# EAGLE design wt32_breakout_v10 (EAGLE 6.4)
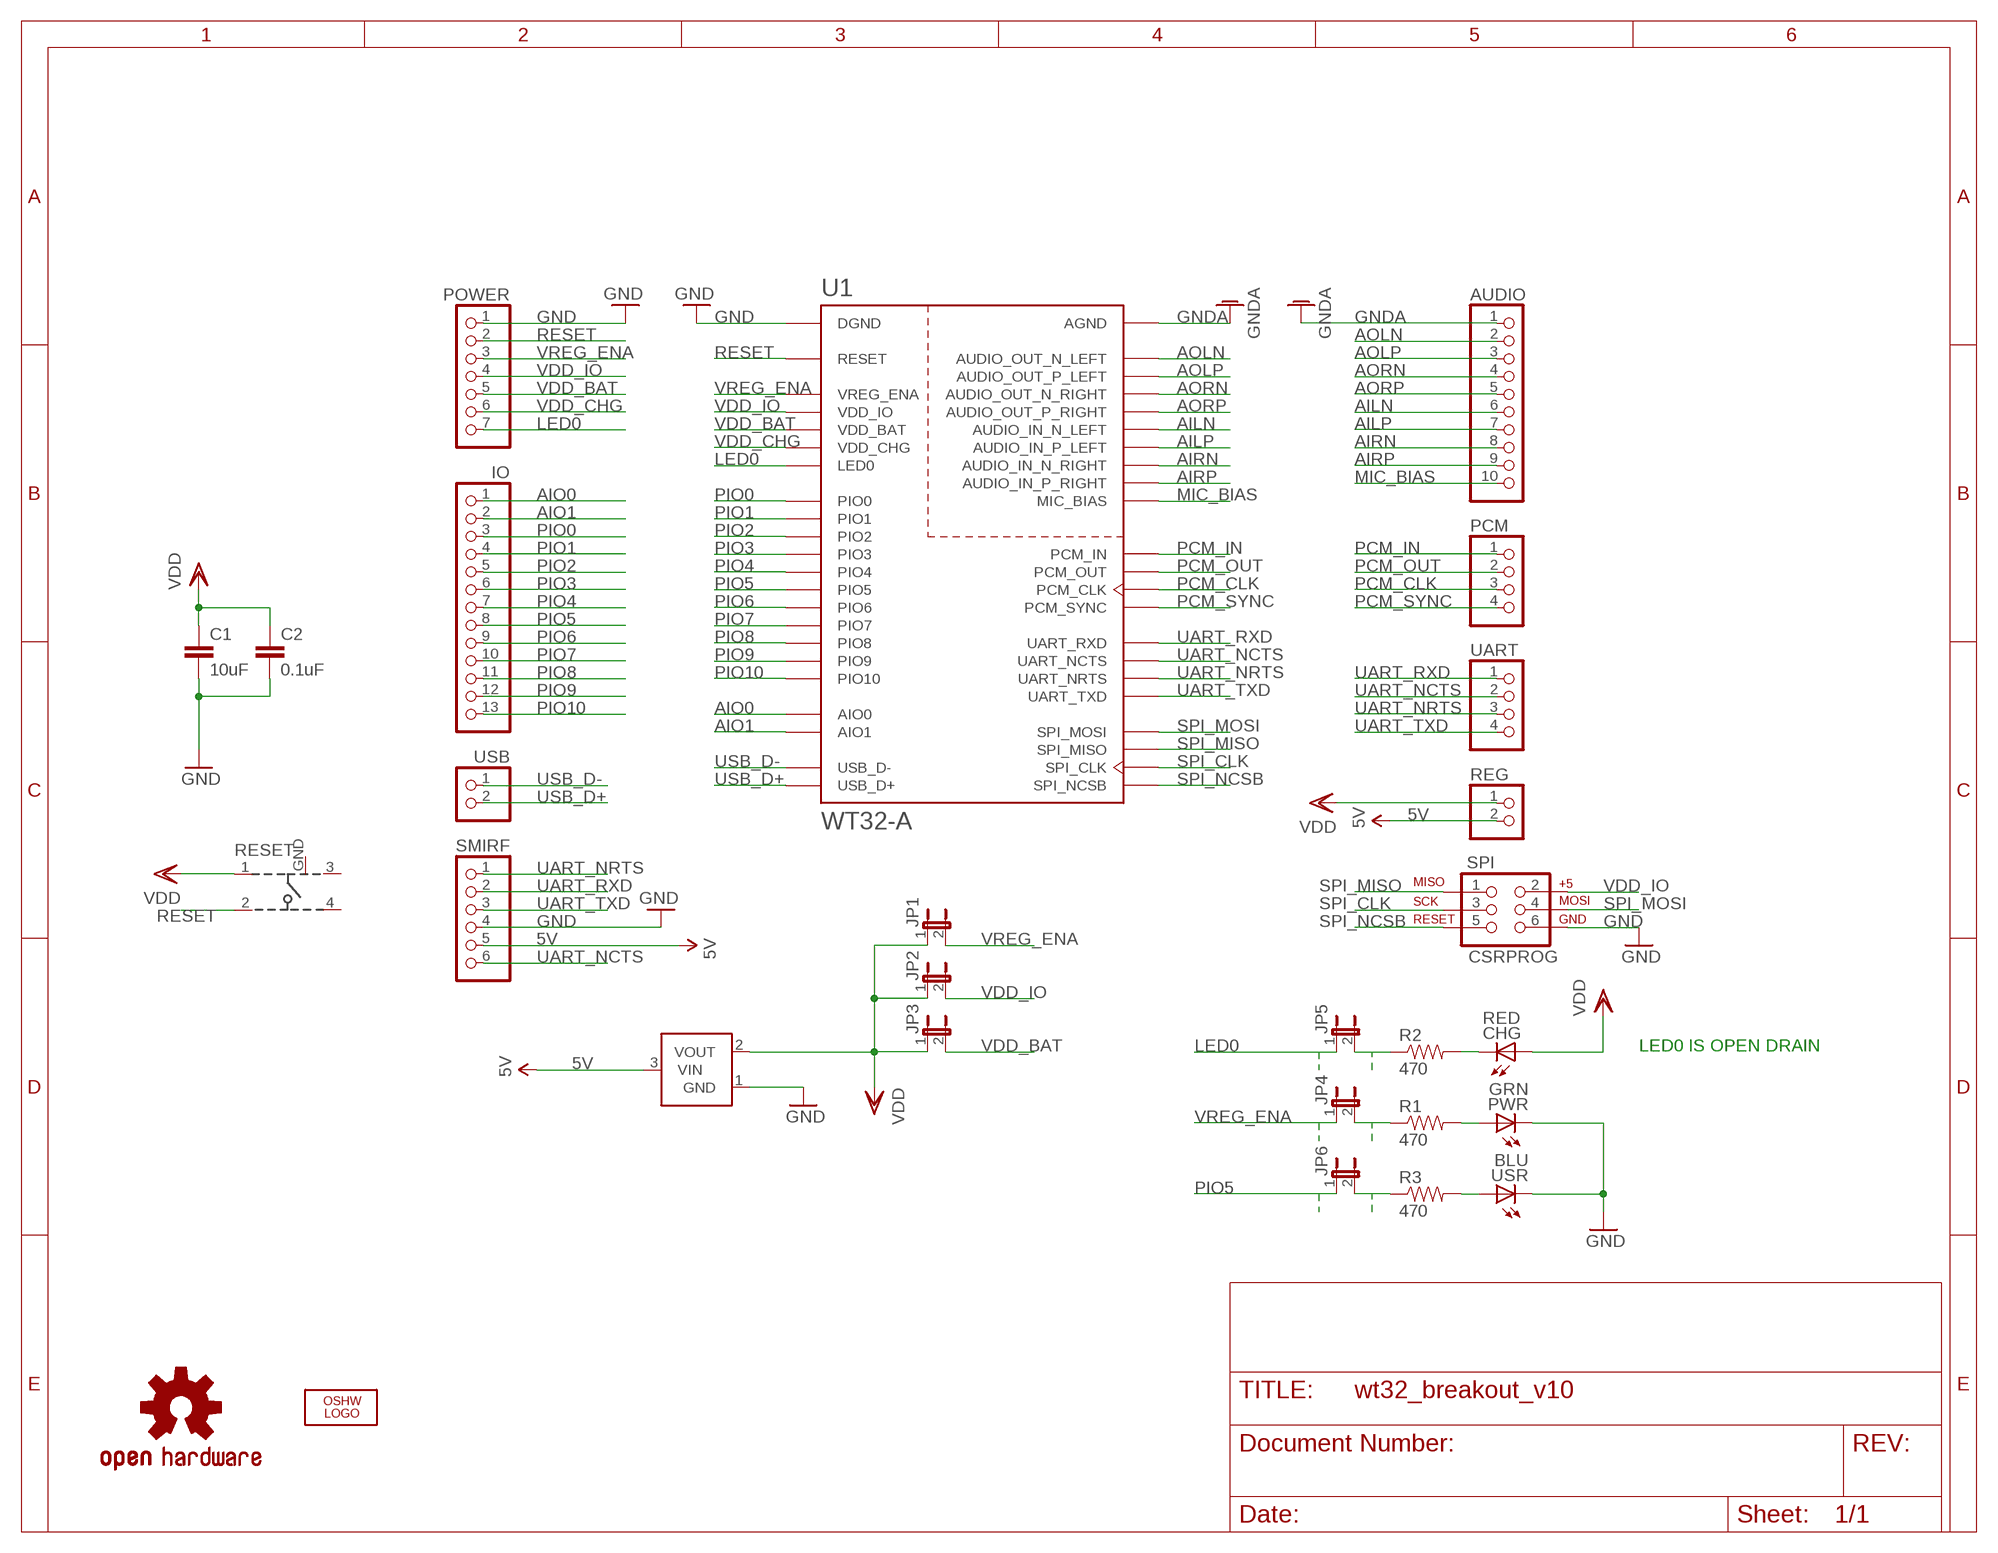
[diagram p0: schematic, sheet 1]

## Parts
AUDIO  PINHD-1X10  [1X10]
C1  10uF  CAP0603-CAP  [0603-CAP]
C2  0.1uF  CAP0603-CAP  [0603-CAP]
CHG  RED  LEDCHIPLED_0805  [CHIPLED_0805]
IO  PINHD-1X13  [1X13]
JP1  JUMPER-2PTH  [1X02]
JP2  JUMPER-2PTH  [1X02]
JP3  JUMPER-2PTH  [1X02]
JP4  JUMPER-2SMD-NC  [SJ_2S]
JP5  JUMPER-2SMD-NC  [SJ_2S]
JP6  JUMPER-2SMD-NC  [SJ_2S]
LOGO1  OSHW_LOGO_FILLX0070-NT  [OSHW_FILLX70_NOTEXT]
PCM  PINHD-1X4  [1X04]
POWER  PINHD-1X7  [1X07]
PWR  GRN  LEDCHIPLED_0805  [CHIPLED_0805]
R1  470  RESISTOR0603-RES  [0603-RES]
R2  470  RESISTOR0603-RES  [0603-RES]
R3  470  RESISTOR0603-RES  [0603-RES]
REG  PINHD-1X2  [1X02]
RESET  101-IG  [101-IG]
SMIRF  PINHD-1X6  [1X06]
SPI  CSRPROG  AVR_SPI_PRG_6PTH  [2X3]
U1  WT32-A  [WT32-A]
U2  MCP1700  [SOT23-3]
U$5  OSHW-LOGOM  [OSHW-LOGO-M]
UART  PINHD-1X4  [1X04]
USB  PINHD-1X2  [1X02]
USR  BLU  LEDCHIPLED_0805  [CHIPLED_0805]

## Nets
5V [power]: REG.2 SMIRF.5 U2.3(VIN)
AILN: AUDIO.6 U1.AUDIO_IN_N_LEFT
AILP: AUDIO.7 U1.AUDIO_IN_P_LEFT
AIO0: IO.1 U1.AIO0
AIO1: IO.2 U1.AIO1
AIRN: AUDIO.8 U1.AUDIO_IN_N_RIGHT
AIRP: AUDIO.9 U1.AUDIO_IN_P_RIGHT
AOLN: AUDIO.2 U1.AUDIO_OUT_N_LEFT
AOLP: AUDIO.3 U1.AUDIO_OUT_P_LEFT
AORN: AUDIO.4 U1.AUDIO_OUT_N_RIGHT
AORP: AUDIO.5 U1.AUDIO_OUT_P_RIGHT
GND [power]: C1.2 C2.2 POWER.1 PWR.C SMIRF.4 SPI.6 U1.DGND U1.DGND@2(DGND) U1.DGND@3(DGND) U1.DGND@4(DGND) U1.DGND@5(DGND) U2.1(GND) USR.C
GNDA: AUDIO.1 U1.AGND U1.AGND@2(AGND) U1.AGND@3(AGND)
LED0: JP5.1 POWER.7 U1.LED0
MIC_BIAS: AUDIO.10 U1.MIC_BIAS
N$1: PWR.A R1.2
N$2: CHG.C R2.2
N$3: R3.2 USR.A
N$4: JP6.2 R3.1
N$5: JP4.2 R1.1
N$6: JP5.2 R2.1
PCM_CLK: PCM.3 U1.PCM_CLK
PCM_IN: PCM.1 U1.PCM_IN
PCM_OUT: PCM.2 U1.PCM_OUT
PCM_SYNC: PCM.4 U1.PCM_SYNC
PIO0: IO.3 U1.PIO0
PIO1: IO.4 U1.PIO1
PIO2: IO.5 U1.PIO2
PIO3: IO.6 U1.PIO3
PIO4: IO.7 U1.PIO4
PIO5: IO.8 JP6.1 U1.PIO5
PIO6: IO.9 U1.PIO6
PIO7: IO.10 U1.PIO7
PIO8: IO.11 U1.PIO8
PIO9: IO.12 U1.PIO9
PIO10: IO.13 U1.PIO10
RESET: POWER.2 RESET.2 U1.RESET
SPI_CLK: SPI.3 U1.SPI_CLK
SPI_MISO: SPI.1 U1.SPI_MISO
SPI_MOSI: SPI.4 U1.SPI_MOSI
SPI_NCSB: SPI.5 U1.SPI_NCSB
UART_NCTS: SMIRF.6 U1.UART_NCTS UART.2
UART_NRTS: SMIRF.1 U1.UART_NRTS UART.3
UART_RXD: SMIRF.2 U1.UART_RXD UART.1
UART_TXD: SMIRF.3 U1.UART_TXD UART.4
USB_D+: U1.USB_D+ USB.2
USB_D-: U1.USB_D- USB.1
VDD [power]: C1.1 C2.1 CHG.A JP1.1 JP2.1 JP3.1 REG.1 RESET.1 U2.2(VOUT)
VDD_BAT [power]: JP3.2 POWER.5 U1.VDD_BAT
VDD_CHG: POWER.6 U1.VDD_CHG
VDD_IO: JP2.2 POWER.4 SPI.2 U1.VDD_IO
VREG_ENA: JP1.2 JP4.1 POWER.3 U1.VREG_ENA
Unconnected: RESET.3 RESET.4

## Notes on the sheet
- LED0 IS OPEN DRAIN

## Power pins joined to a net without a drawn wire
GND: RESET.GND

## Library data of the parts
AUDIO = sf-pinhead:PINHD-1X10: PIN HEADER
C1 C2 = SparkFun:CAP: Capacitor Standard 0603 ceramic capacitor, and 0.1" leaded capacitor.
CHG PWR USR = adafruit:LED: LED OSRAM: - CHIPLED LG R971, LG N971, LY N971, LG Q971, LY Q971, LO R971, LY R971 LH N974, LH R974 LS Q976, LO Q976, LY Q976 LO Q996 - Hyper CHIPLED LW Q18S LB Q993, LB Q99A, LB R99A - SideLED LS A670, LO A670, LY A670, LG A670, LP A670 LB A673, LV A673, LT A673, LW A673 LH A674 LY A675 LS A676, LA A676, LO A676, LY A676, LW A676 LS A679, LY A679, LG A679 - Hyper Micro SIDELED® LS Y876, LA Y876, LO Y876, LY Y876 LT Y87S - SmartLED LW L88C, LW L88S LB L89C, LB L89S, LG L890 LS L89K, LO L89K, LY L89K LS L896, LA L896, LO L896, LY L896 - TOPLED LS T670, LO T670, LY T670, LG T670, LP T670 LSG T670, LSP T670, LSY T670, LOP T670, LYG T670 LG T671, LOG T671, LSG T671 LB T673, LV T673, LT T673, LW T673 LH T674 LS T676, LA T676, LO T676, LY T676, LB T676, LH T676, LSB T676, LW T676 LB T67C, LV T67C, LT T67C, LS T67K, LO T67K, LY T67K, LW E67C LS E67B, LA E67B, LO E67B, LY E67B, LB E67C, LV E67C, LT E67C LW T67C LS T679, LY T679, LG T679 LS T770, LO T770, LY T770, LG T770, LP T770 LB T773, LV T773, LT T773, LW T773 LH T774 LS E675, LA E675, LY E675, LS T675 LS T776, LA T776, LO T776, LY T776, LB T776 LHGB T686 LT T68C, LB T68C - Hyper Mini TOPLED® LB M676 - Mini TOPLED Santana® LG M470 LS M47K, LO M47K, LY M47K Source: http://www.osram.convergy.de/
IO = sf-pinhead:PINHD-1X13: PIN HEADER
JP1-JP6 = SparkFun:JUMPER-2: Jumper Basic 0.1" spaced jumper. Use with breakaway headers.
LOGO1 = oshw-logo:OSHW_LOGO_FILL
PCM UART = sf-pinhead:PINHD-1X4: PIN HEADER
POWER = sf-pinhead:PINHD-1X7: PIN HEADER
R1-R3 = SparkFun:RESISTOR: Resistor Basic schematic elements and footprints for 0603, 1206, and PTH resistors.
REG USB = sf-pinhead:PINHD-1X2: PIN HEADER
RESET = sf-keyglove:101-IG
SMIRF = sf-pinhead:PINHD-1X6: PIN HEADER
SPI = SparkFun:AVR_SPI_PRG_6: AVR ISP 6 Pin This is the reduced ISP connector for AVR programming. Common on Arduino. This footprint will take up less PCB space and can be used with a 10-pin to 6-pin adapter such as SKU: BOB-08508
U1 = sf-bluegiga:WT32-A: Class 2 Bluetooth Audio module - Bluetooth 2.1 + EDR w/stereo analog audio (A2DP) support, chip antenna
U2 = nonolith:MCP1700: Voltage regulator
U$5 = SparkFun:OSHW-LOGO: Open Source Hardware Logo This logo indicates the piece of hardware it is found on incorporates a OSHW license and/or adheres to the definition of open source hardware found here: http://freedomdefined.org/OSHW

## Net classes
0 default: width 0.152 mm, drill 0.33 mm, clearance 0.152 mm
1 power: width 0.254 mm, drill 0.33 mm, clearance 0.152 mm

## Board
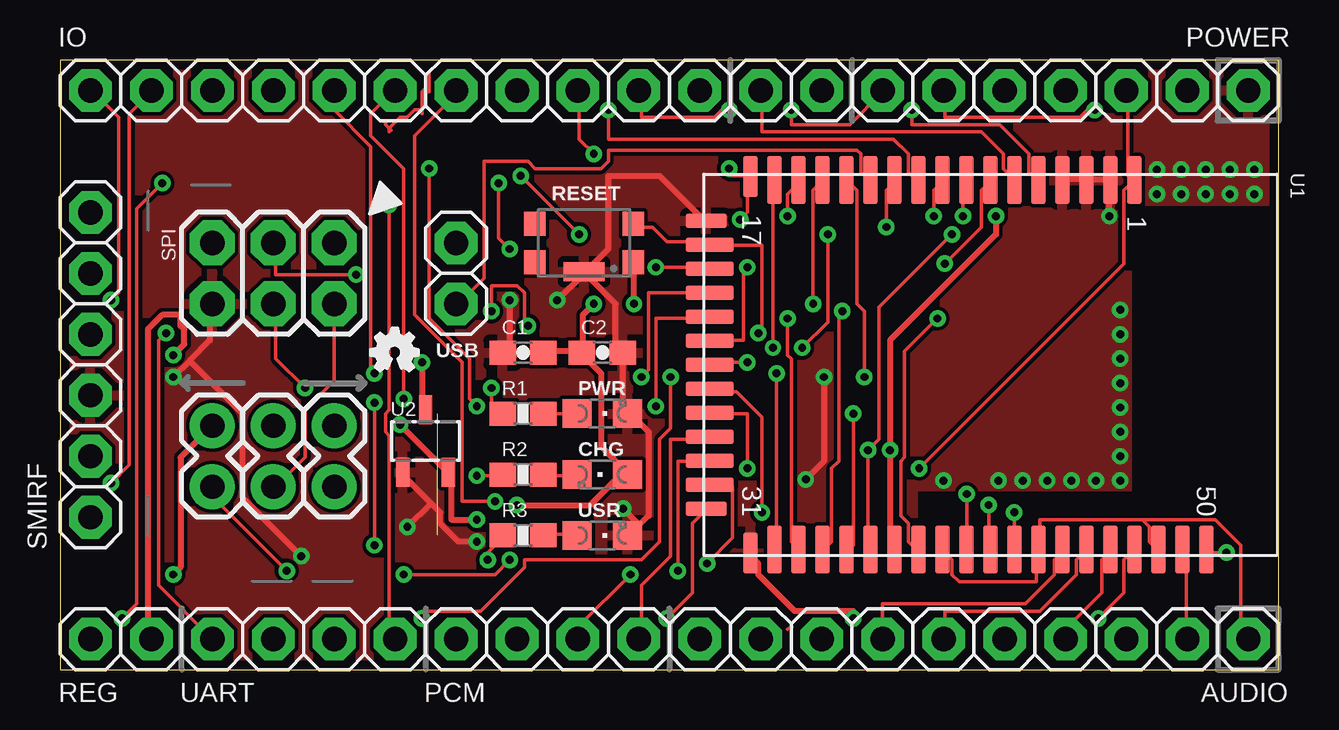
[diagram p1: board, top side]
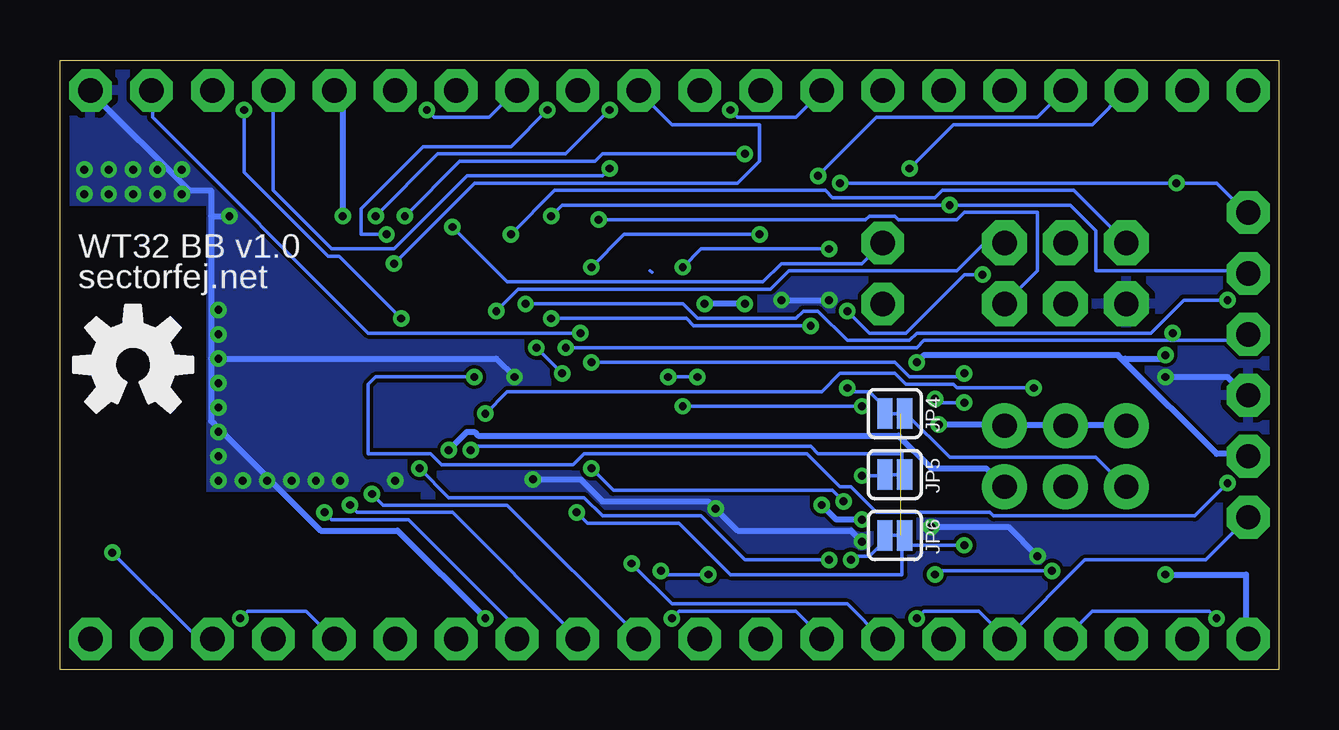
[diagram p2: board, bottom side, seen from below]

Size 50.8 x 25.4 mm. Coordinates in mm from the lower left corner, seen from the top.
Outline: 0,0 50.8,0 50.8,25.4 0,25.4 0,0
Copper layers (1*16): Top 0.0356mm / dielectric 1.5011mm / Bottom 0.0356mm
Design rules "LaenPCBOrder *": minimum track width 6mil, minimum drill 13mil, track to track 6mil, track to pad 6mil, pad to pad 6mil, via to via 6mil, smd to smd 6mil, copper to edge 15mil, drill to drill 6mil, minimum pad ring 7mil, minimum via ring 7mil, stop-mask expansion 4mil, vias tented up to drill 13mil, thermal gap 10mil
tRestrict: area 44.7,6.6 to 50.8,19.3
bRestrict: area 44.7,6.6 to 50.8,19.3
vRestrict: area 0,22 to 50.8,22.9; area 0,2.5 to 50.8,3.6; area 2.5,5.1 to 3.8,20.3; area 5.1,19.1 to 12.7,20.3; area 5.1,12.7 to 12.7,14; area 5.1,5.1 to 12.7,6.3; area 21.6,11.4 to 23.1,11.9; area 21.6,8.9 to 23.1,9.4; area 21.6,6.3 to 23.1,6.9

### Footprints (pad centres in the part's own frame; a part is rotated, then mirrored left to right if it is on the bottom)
1X10 = drill 1.016 pad 1.778 octagon: 1 -11.43,0; 2 -8.89,0; 3 -6.35,0; 4 -3.81,0; 5 -1.27,0; 6 1.27,0; 7 3.81,0; 8 6.35,0; 9 8.89,0; 10 11.43,0
0603-CAP = smd 1.1 x 1: 1 -0.85,0; 2 0.85,0
CHIPLED_0805 = smd 1.2 x 1.2: A 0,-1.05; C 0,1.05
1X13 = drill 1.016 pad 1.778 octagon: 1 -15.24,0; 2 -12.7,0; 3 -10.16,0; 4 -7.62,0; 5 -5.08,0; 6 -2.54,0; 7 0,0; 8 2.54,0; 9 5.08,0; 10 7.62,0; 11 10.16,0; 12 12.7,0; 13 15.24,0
1X02 = drill 1.016 pad 1.88: 1 0,0; 2 2.54,0
SJ_2S = smd 0.635 x 1.27: 1 -0.412,0; 2 0.412,0
1X04 = drill 1.016 pad 1.778 octagon: 1 -3.81,0; 2 -1.27,0; 3 1.27,0; 4 3.81,0
1X07 = drill 1.016 pad 1.778 octagon: 1 -7.62,0; 2 -5.08,0; 3 -2.54,0; 4 0,0; 5 2.54,0; 6 5.08,0; 7 7.62,0
0603-RES = smd 1.1 x 1: 1 -0.85,0; 2 0.85,0
1X02' = drill 1.016 pad 1.778 octagon: 1 -1.27,0; 2 1.27,0
101-IG = smd 0.9 x 1: 1 -2.05,0.8; 2 -2.05,-0.8; 3 2.05,0.8; 4 2.05,-0.8 | smd 1.7 x 0.8: GND 0,1.2
1X06 = drill 1.016 pad 1.778 octagon: 1 -6.35,0; 2 -3.81,0; 3 -1.27,0; 4 1.27,0; 5 3.81,0; 6 6.35,0
2X3 = drill 1.016 pad 1.88 octagon: 1 0,0; 2 0,2.54; 3 2.54,0; 4 2.54,2.54; 5 5.08,0; 6 5.08,2.54
WT32-A = smd 2 x 0.6: AGND 7.7,-2; AGND@2 7.7,2; AGND@3 7.7,7; AIO0 -7.7,2; AIO1 -7.7,1; AUDIO_IN_N_LEFT 7.7,4; AUDIO_IN_N_RIGHT 7.7,1; AUDIO_IN_P_LEFT 7.7,3; AUDIO_IN_P_RIGHT 7.7,0; AUDIO_OUT_N_LEFT 7.7,8; AUDIO_OUT_N_RIGHT 7.7,5; AUDIO_OUT_P_LEFT 7.7,9; AUDIO_OUT_P_RIGHT 7.7,6; DGND -7.7,5; DGND@2 -7.7,4; DGND@3 -7.7,3; LED0 7.7,-5; MIC_BIAS 7.7,-1; PIO0 -7.7,0; PIO1 -7.7,-1; PIO2 -7.7,-2; PIO3 -7.7,-3; PIO9 -7.7,-6; PIO10 -7.7,-7; SPI_CLK 7.7,-8; SPI_MISO 7.7,-7; SPI_MOSI 7.7,-6; SPI_NCSB 7.7,-9; UART_RXD -7.7,-8; UART_TXD -7.7,-9; USB_D+ -7.7,-5; USB_D- -7.7,-4; VDD_BAT 7.7,-4; VDD_CHG 7.7,-3; VREG_ENA -7.7,6 | smd 0.6 x 1.7: DGND@4 -6,-11.85; PCM_CLK 6,-11.85 | smd 1.7 x 0.6: DGND@5 7.85,-10; VDD_IO -7.85,-10 | smd 0.6 x 2: PCM_IN 3,-11.7; PCM_OUT 4,-11.7; PCM_SYNC 5,-11.7; PIO4 2,-11.7; PIO5 1,-11.7; PIO6 0,-11.7; PIO7 -1,-11.7; PIO8 -2,-11.7; RESET -5,-11.7; UART_NCTS -3,-11.7; UART_NRTS -4,-11.7
SOT23-3 = smd 0.55 x 1.2: 1 0.95,1.3; 2 -0.95,1.3; 3 0,-1.3

### Placement (x,y rotation side)
AUDIO  38.1,1.27 180 top
C1  19.3,13.21 180 top
C2  22.61,13.21 0 top
CHG  22.61,8.13 90 top
IO  16.51,24.13 180 top
JP1  6.35,10.16 270 top
JP2  8.89,10.16 270 top
JP3  11.43,10.16 270 top
JP4  16,10.67 180 bottom
JP5  16,8.13 180 bottom
JP6  16,5.59 180 bottom
LOGO1  12.95,12.45 0 top
PCM  20.32,1.27 180 top
POWER  41.91,24.13 180 top
PWR  22.61,10.67 270 top
R1  19.3,10.67 0 top
R2  19.3,8.13 0 top
R3  19.3,5.59 0 top
REG  [1X02']  2.54,1.27 0 top
RESET  21.84,17.78 180 top
SMIRF  1.27,12.7 270 top
SPI  11.43,17.78 180 top
U1  38.79,12.7 270 top
U2  15.24,9.53 180 top
U$5  47.75,12.7 0 bottom
UART  10.16,1.27 180 top
USB  [1X02']  16.51,16.51 270 top
USR  22.61,5.59 270 top

### Tracks (layer width: path | path; a pad name or v marks a point on that pad's centre or on a via)
5V  (via drill 0.33)
  Top 0.254: v15.09,12.8 15.09,11.12 15.24,10.97 U2.3 | v4.72,13.11 5.18,13.56 5.18,14.17 5.03,14.33 5.03,14.78 4.27,14.78 3.66,14.17 3.66,1.52 3.81,1.37 REG.2
  Bottom 0.254: v15.09,12.8 14.78,13.11 6.71,13.11 6.48,12.88 | 6.48,12.88 2.59,8.99 1.37,8.99 SMIRF.5 | v4.72,13.11 4.88,12.95 6.4,12.95 6.48,12.88
AILN
  Top 0.152: U1.AUDIO_IN_N_LEFT 42.67,4.88 42.37,4.57 42.37,3.96 40.84,2.44 36.88,2.44 36.88,1.37 AUDIO.6
AILP
  Top 0.152: AUDIO.7 34.29,2.74 40.23,2.74 41.45,3.96 41.45,4.57 41.76,4.88 U1.AUDIO_IN_P_LEFT
AIO0  (via drill 0.33)
  Top 0.152: v35.51,23.32 35.51,22.71 39.17,22.71 40.39,21.49 40.39,20.73 40.69,20.42 U1.AIO0
  Bottom 0.152: v35.51,23.32 35.2,23.01 32.92,23.01 31.85,24.08 IO.1
AIO1
  Top 0.152: U1.AIO1 39.78,20.42 39.32,20.88 39.32,21.49 38.41,22.4 29.26,22.4 29.26,24.08 IO.2
AIRN  (via drill 0.33)
  Top 0.152: v39.78,6.55 39.78,5.03 U1.AUDIO_IN_N_RIGHT
  Bottom 0.152: v39.78,6.55 39.47,6.25 36.27,6.25 31.85,1.83 31.85,1.37 AUDIO.8
AIRP  (via drill 0.33)
  Top 0.152: v38.71,6.86 38.71,5.03 U1.AUDIO_IN_P_RIGHT
  Bottom 0.152: v38.71,6.86 38.41,6.55 34.44,6.55 29.26,1.37 AUDIO.9
AOLN
  Top 0.152: U1.AUDIO_OUT_N_LEFT 46.79,4.88 46.94,4.72 46.94,1.37 AUDIO.2
AOLP  (via drill 0.33)
  Top 0.152: v48.62,4.88 47.85,4.88 U1.AUDIO_OUT_P_LEFT
  Bottom 0.152: v48.62,4.88 45.11,1.37 44.5,1.37 AUDIO.3
AORN
  Top 0.152: AUDIO.4 41.91,1.68 43.43,3.2 43.43,4.57 43.74,4.88 U1.AUDIO_OUT_N_RIGHT
AORP  (via drill 0.33)
  Top 0.152: v43.28,2.13 44.35,3.2 44.35,4.57 44.65,4.88 U1.AUDIO_OUT_P_RIGHT
  Bottom 0.152: v43.28,2.13 42.98,2.44 40.54,2.44 AUDIO.5
GND  (via drill 0.33)
  Top 0.254: 5.41,12.88 6.25,13.72 6.25,15.24 SPI.6 | 5.41,12.88 v4.72,12.19 | v18.75,15.39 18.75,13.41 18.59,13.26 C1.2 | v20.73,15.39 21.79,16.46 RESET.GND | U1.DGND@4 26.82,18.75 24.99,20.57 22.86,20.57 22.86,17.53 21.95,16.61 RESET.GND | 14.33,8.23 U2.1 14.33,8.08 15.47,6.93 | 15.47,6.93 15.85,6.55 15.85,6.1 16.61,5.33 v17.37,5.33 | v23.47,6.71 24.08,6.1 USR.C 23.77,5.64 24.54,6.4 24.54,9.91 23.77,10.67 PWR.C 23.62,10.67 23.47,10.82 23.47,13.11 C2.2 23.32,13.26 23.16,13.41 23.16,15.24 21.95,16.46 RESET.GND | 5.41,12.88 7.62,10.67 7.62,7.16 v10.06,4.72 | 15.47,6.93 v14.48,5.94 | U1.DGND@3 41.91,20.42 42.67,20.42 U1.DGND@2 42.82,20.42 43.74,20.42 U1.DGND 43.74,20.27 v43.74,18.9 | v33.07,2.13 33.07,2.44 30.63,2.44 29.11,3.96 29.11,4.42 28.8,4.72 U1.DGND@5 | v31.09,7.92 31.85,8.69 v31.85,12.19
  Bottom 0.254: v4.72,12.19 2.13,12.19 1.37,11.43 SMIRF.4 | v20.73,15.39 v18.75,15.39 | v17.37,5.33 17.83,5.79 22.55,5.79 v23.47,6.71 23.77,7.01 28.19,7.01 29.11,7.92 v31.09,7.92 | v10.06,4.72 11.28,5.94 v14.48,5.94 | v33.07,2.13 36.73,5.79 39.93,5.79 44.5,10.36 44.5,12.95 | 44.5,18.9 44.5,19.96 45.41,19.96 49.53,24.08 POWER.1 | 44.5,18.9 44.5,12.95 | 44.5,18.9 v43.74,18.9 | v31.85,12.19 32.61,12.95 44.5,12.95
  other vias: 44.2,7.87 43.18,7.87 42.16,7.87 41.15,7.87 40.13,7.87 39.12,7.87 36.83,7.87 44.2,8.89 44.2,9.91 44.2,10.92 44.2,11.94 44.2,12.95 44.2,13.97 44.2,14.99 45.72,19.81 46.74,19.81 47.75,19.81 48.77,19.81 49.78,19.81 49.78,20.83 48.77,20.83 47.75,20.83 46.74,20.83 45.72,20.83
  pour Bottom: 0,25.4 50.8,25.4 50.8,7.62 35.56,7.62 35.56,5.08 25.4,5.08 25.4,0 0,0
  pour Top: 0,25.4 50.8,25.4 50.8,7.62 35.56,7.62 35.56,5.08 25.4,5.08 25.4,0 0,0
GND2
  Bottom 0.152: 26.21,16.61 26.12,16.55
GND3
  Top 0.152: 13.41,22.86 13.54,22.83 13.56,22.86 13.56,22.71 | 13.79,22.48 13.72,22.4 13.72,22.55 | 15.21,24.08 15.39,24.08 15.39,24.38 | 15.01,23.24 15.09,23.16 15.09,23.32 | 13.56,22.71 | 13.56,22.71 13.72,22.55 | 15.39,24.38 15.39,24.84 | 15.09,23.32 15.09,24.08 15.39,24.38 | 13.72,22.55 14.17,23.01 14.48,23.01 14.78,23.32 15.09,23.32
GNDA
  Top 0.152: U1.AGND 36.88,4.88 37.19,4.57 37.19,3.96 37.49,3.66 40.69,3.66 40.69,4.88 U1.AGND@2 40.84,5.03 40.84,6.25 45.11,6.25 | 45.11,6.25 45.41,5.94 45.41,5.33 45.72,5.03 U1.AGND@3 | 45.11,6.25 48.16,6.25 49.23,5.18 49.23,1.68 49.53,1.37 AUDIO.1
GNDB
  Top 0.152: 30.33,1.68 30.5,1.79
LED0  (via drill 0.33)
  Top 0.152: U1.LED0 33.68,5.03 v33.68,9.14 34.14,9.6 34.14,15.09 v37.19,18.14 | v30.48,23.32 30.48,22.71 32.92,22.71 34.29,24.08 POWER.7
  Bottom 0.152: v33.68,9.14 33.53,9.3 19.51,9.3 19.2,8.99 15.7,8.99 15.7,8.23 JP5.1 | v30.48,23.32 32,21.79 35.66,21.79 38.25,19.2 38.25,18.14 v37.19,18.14
MIC_BIAS  (via drill 0.33)
  Top 0.152: v37.8,7.32 37.8,5.03 U1.MIC_BIAS
  Bottom 0.152: v37.8,7.32 37.34,6.86 32.16,6.86 26.67,1.37 AUDIO.10
N$1
  Top 0.152: PWR.A R1.2
N$2
  Top 0.152: R2.2 20.27,8.08 21.49,8.08 CHG.C
N$3
  Top 0.152: R3.2 20.27,5.64 21.49,5.64 USR.A
N$4  (via drill 0.33)
  Top 0.152: v17.83,4.57 17.83,4.88 18.44,5.49 R3.1
  Bottom 0.152: v17.83,4.57 17.68,4.72 17.07,4.72 16.31,5.49 JP6.2
N$5  (via drill 0.33)
  Top 0.152: v17.98,11.73 17.98,11.12 R1.1
  Bottom 0.152: v17.98,11.73 17.83,11.58 17.07,11.58 16.46,10.97 16.46,10.67 JP4.2
N$6  (via drill 0.33)
  Top 0.152: v17.37,8.08 18.44,8.08 R2.1
  Bottom 0.152: v17.37,8.08 16.46,8.08 JP5.2
N$7  (2 unrouted)
  Bottom 0.152: 15.75,10.67 16.26,10.67 | 15.75,8.13 16.26,8.13 | 15.75,5.59 16.26,5.59
PCM_CLK  (via drill 0.33)
  Top 0.152: v25.3,2.13 26.36,3.2 26.36,6.1 26.82,6.55 U1.PCM_CLK
  Bottom 0.152: v25.3,2.13 24.99,2.44 20.12,2.44 19.05,1.37 PCM.3
PCM_IN
  Top 0.152: U1.PCM_IN 26.98,9.6 25.45,9.6 25.45,4.72 24.23,3.5 24.23,1.37 PCM.1
PCM_OUT  (via drill 0.33)
  Top 0.152: v25.76,4.12 25.76,8.69 26.98,8.69 U1.PCM_OUT | v23.77,3.96 21.64,1.83 21.64,1.37 PCM.2
  Bottom 0.152: v25.76,4.12 25.6,3.96 v23.77,3.96
PCM_SYNC  (via drill 0.33)
  Top 0.152: v26.98,4.42 28.04,5.49 28.04,7.62 27.13,7.62 U1.PCM_SYNC
  Bottom 0.152: v26.98,4.42 25.3,2.74 17.98,2.74 PCM.4
PIO0  (via drill 0.33)
  Top 0.152: v36.88,16.92 38.41,18.44 38.41,19.96 38.71,20.27 U1.PIO0
  Bottom 0.152: v36.88,16.92 33.53,20.27 22.55,20.27 21.64,21.18 21.64,22.71 25.3,22.71 26.67,24.08 IO.3
PIO1  (via drill 0.33)
  Top 0.152: v37.64,18.9 37.64,20.27 U1.PIO1 | v27.89,23.32 27.58,23.32 27.28,23.01 24.23,23.01 24.23,24.08 IO.4
  Bottom 0.152: v37.64,18.9 35.05,21.49 29.72,21.49 v27.89,23.32
PIO2  (via drill 0.33)
  Top 0.152: v36.42,18.9 36.42,19.96 36.73,20.27 U1.PIO2 | v22.25,21.49 21.64,22.1 21.64,24.08 IO.5
  Bottom 0.152: v36.42,18.9 34.14,21.18 28.5,21.18 28.19,21.49 v22.25,21.49
PIO3  (via drill 0.33)
  Top 0.152: v22.86,23.32 22.86,22.1 34.75,22.1 35.36,21.49 35.36,20.73 35.66,20.42 U1.PIO3
  Bottom 0.152: v22.86,23.32 22.55,23.01 20.12,23.01 19.05,24.08 IO.6
PIO4  (via drill 0.33)
  Top 0.152: v28.65,8.38 28.65,10.67 27.13,10.67 U1.PIO4 | v18.14,7.01 16.76,7.01 16.76,12.8 14.78,14.78 14.78,22.25 16.46,23.93 16.46,24.08 IO.7
  Bottom 0.152: v28.65,8.38 27.74,7.47 18.59,7.47 v18.14,7.01
PIO5  (via drill 0.33)
  Top 0.152: v29.26,6.55 29.26,10.52 28.19,11.58 27.13,11.58 U1.PIO5 | v14.33,11.28 14.33,20.88 12.95,22.25 12.95,23.16 13.87,24.08 IO.8 | v13.11,5.18 v13.11,11.12
  Bottom 0.152: 15.7,5.18 15.7,3.96 22.86,3.96 24.99,6.1 28.8,6.1 v29.26,6.55 | 15.7,5.18 15.7,5.49 JP6.1 15.7,5.18 | v14.33,11.28 14.17,11.12 v13.11,11.12 | 15.7,5.18 v13.11,5.18
PIO6  (via drill 0.33)
  Top 0.152: v28.65,12.8 27.13,12.8 U1.PIO6 | v13.11,12.34 12.95,12.5 12.95,21.79 11.43,23.32 IO.9
  Bottom 0.152: v28.65,12.8 16,12.8 15.39,12.19 13.26,12.19 v13.11,12.34
PIO7  (via drill 0.33)
  Top 0.152: v28.65,16.76 28.5,16.61 28.5,13.72 27.13,13.72 U1.PIO7 | v19.2,20.57 v21.64,18.14
  Bottom 0.152: v28.65,16.76 27.28,18.14 v21.64,18.14 | v19.2,20.57 16.76,23.01 10.06,23.01 8.99,24.08 IO.10
PIO8  (via drill 0.33)
  Top 0.152: v24.84,10.97 24.84,14.63 26.98,14.63 U1.PIO8 | v17.37,10.97 17.07,11.28 17.07,12.95 15.39,14.63 v15.39,20.88
  Bottom 0.152: v17.37,10.97 v24.84,10.97 | v15.39,20.88 13.56,22.71 7.77,22.71 IO.11
PIO9  (via drill 0.33)
  Top 0.152: v33.53,12.19 33.53,14.94 33.22,15.24 33.22,19.96 32.92,20.27 U1.PIO9 | v2.13,7.77 2.9,8.53 2.9,23.16 3.81,24.08 IO.12
  Bottom 0.152: v33.53,12.19 37.64,12.19 37.95,11.89 37.95,8.99 35.36,8.99 34.9,8.53 29.41,8.53 28.96,8.99 19.66,8.99 18.29,7.62 17.83,7.62 16.76,6.55 12.04,6.55 11.89,6.4 3.5,6.4 v2.13,7.77
PIO10  (via drill 0.33)
  Top 0.152: v31.39,15.24 31.39,19.96 31.7,20.27 U1.PIO10 | v2.13,15.39 2.44,15.7 2.44,23.01 1.37,24.08 IO.13
  Bottom 0.152: v31.39,15.24 24.84,15.24 24.23,14.63 20.12,14.63 19.81,14.94 19.2,14.94 17.98,13.72 15.39,13.72 15.09,14.02 5.33,14.02 3.96,15.39 v2.13,15.39
RESET  (via drill 0.33)
  Top 0.152: RESET.2 23.93,18.44 24.69,18.44 25.3,17.83 26.98,17.83 U1.RESET 27.13,17.68 29.26,17.68 29.26,14.17 v29.11,14.02
  Bottom 0.152: v29.11,14.02 37.95,14.02 46.94,23.01 46.94,24.08 POWER.2
SPI_CLK  (via drill 0.33)
  Top 0.152: v30.33,14.63 30.33,13.11 30.48,12.95 30.48,5.33 30.79,5.03 U1.SPI_CLK | v19.51,14.33 19.36,14.48 19.36,15.7 19.05,16 17.98,16 v17.98,14.94 | v12.34,16.46 8.99,16.46 8.99,17.68 SPI.3
  Bottom 0.152: v30.33,14.63 24.69,14.63 24.38,14.33 v19.51,14.33 | v17.98,14.94 17.07,14.02 15.54,14.02 13.11,16.46 v12.34,16.46
SPI_MISO  (via drill 0.33)
  Top 0.152: v32.61,14.94 32.46,14.78 32.46,8.69 32.16,8.38 32.16,5.33 31.85,5.03 U1.SPI_MISO
  Bottom 0.152: v32.61,14.94 31.7,15.85 21.18,15.85 20.42,16.61 13.41,16.61 12.34,17.68 11.43,17.68 SPI.1
SPI_MOSI  (via drill 0.33)
  Top 0.152: v33.07,10.67 33.07,5.18 32.92,5.03 U1.SPI_MOSI | v10.21,11.73 8.99,12.95 8.99,15.24 SPI.4
  Bottom 0.152: v33.07,10.67 32.16,11.58 19.05,11.58 18.29,12.34 16,12.34 15.54,11.89 13.56,11.89 13.41,11.73 v10.21,11.73
SPI_NCSB  (via drill 0.33)
  Top 0.152: v29.87,12.34 29.87,5.03 U1.SPI_NCSB | v30.94,13.41 32,14.48 v32,18.14
  Bottom 0.152: v30.94,13.41 v29.87,12.34 | v32,18.14 30.18,19.96 18.9,19.96 18.59,19.66 14.33,19.66 14.02,19.96 8.53,19.96 SPI.5
UART_NCTS  (via drill 0.33)
  Top 0.152: v24.23,12.19 24.54,12.5 24.54,15.7 26.98,15.7 U1.UART_NCTS | v25.45,12.19 25.45,10.06 24.99,9.6 24.99,5.33 24.23,4.57 19.36,4.57 19.36,4.27 17.53,2.44 15.09,2.44 v15.09,2.13
  Bottom 0.152: v25.45,12.19 v24.23,12.19 | v15.09,2.13 14.78,2.44 12.5,2.44 11.43,1.37 | SMIRF.6 3.05,4.57 8.08,4.57 11.28,1.37 11.43,1.37 | 11.43,1.37 UART.2
UART_NRTS  (via drill 0.33)
  Top 0.152: v24.84,16.76 26.98,16.76 U1.UART_NRTS | v18.75,17.53 18.29,17.98 v18.29,20.27 | v2.59,2.13 3.2,2.74 3.2,19.2 v4.27,20.27
  Bottom 0.152: v24.84,16.76 24.08,17.53 v18.75,17.53 | v18.29,20.27 v4.27,20.27 2.59,20.27 1.37,19.05 SMIRF.1 | v2.59,2.13 2.9,2.44 7.77,2.44 8.84,1.37 UART.3
UART_RXD  (via drill 0.33)
  Top 0.152: v30.33,18.9 30.33,19.81 30.79,20.27 U1.UART_RXD | UART.1 13.72,1.52 13.72,9.75 13.56,9.91 13.56,10.67 13.72,10.82 v13.72,19.36
  Bottom 0.152: v30.33,18.9 29.87,19.36 v13.72,19.36 8.69,19.36 7.62,18.29 7.62,16.61 1.37,16.61 SMIRF.2
UART_TXD  (via drill 0.33)
  Top 0.152: v29.72,13.41 29.72,20.27 U1.UART_TXD | UART.4 4.12,3.5 4.12,13.72 v4.42,14.02
  Bottom 0.152: v29.72,13.41 15.09,13.41 14.78,13.72 4.42,13.72 | 4.42,13.72 1.52,13.72 SMIRF.3 | 4.42,13.72 v4.42,14.02
USB_D+
  Top 0.152: U1.USB_D+ 33.68,20.42 33.38,20.73 33.38,21.49 33.22,21.64 22.86,21.64 22.86,21.18 22.55,20.88 19.81,20.88 19.51,21.18 17.68,21.18 17.68,16.31 16.61,15.24 USB.2
USB_D-  (via drill 0.33)
  Top 0.152: v34.44,18.44 34.44,19.96 34.75,20.27 U1.USB_D-
  Bottom 0.152: v34.44,18.44 32.16,16.15 21.49,16.15 20.73,16.92 17.37,16.92 USB.1
VDD  (via drill 0.33)
  Top 0.254: v4.72,3.96 5.03,4.27 5.03,8.84 JP1.1 | v23.93,15.24 23.93,16.92 RESET.1 | v22.25,15.24 21.79,14.78 21.79,13.26 C2.1 | C1.1 20.27,13.26 21.64,13.26 C2.1 | C2.1 21.79,13.11 22.55,12.34 22.55,9.3 23.62,8.23 CHG.A 23.47,8.23 22.1,6.86 v19.05,6.86 | v14.17,10.21 16.15,8.23 U2.2 16.31,8.08 16.31,6.25 v17.37,6.25
  Bottom 0.254: v4.72,3.96 1.37,3.96 1.37,1.37 REG.1 | v22.25,15.24 v23.93,15.24 | 11.43,10.21 v14.17,10.21 | 11.43,10.21 8.99,10.21 JP2.1 8.84,10.21 6.4,10.21 JP1.1 | 11.43,10.21 JP3.1 | v19.05,6.86 18.44,6.25 v17.37,6.25
VDD_BAT  (via drill 0.33)
  Top 0.254: v39.01,18.9 39.01,18.14 34.59,13.72 v34.59,9.14 34.59,5.18 34.75,5.03 U1.VDD_BAT
  Bottom 0.254: v39.01,18.9 39.01,24.08 39.32,24.08 POWER.5 | JP3.2 12.19,8.38 14.48,8.38 15.85,9.75 33.38,9.75 33.53,9.91 33.83,9.91 v34.59,9.14
VDD_CHG  (via drill 0.33)
  Top 0.152: v36.58,14.63 35.2,13.26 35.2,8.84 35.05,8.69 35.05,6.4 35.36,6.1 35.36,5.33 35.66,5.03 U1.VDD_CHG | v43.13,23.32 42.82,23.32 42.52,23.01 36.88,23.01 36.88,24.08 POWER.6
  Bottom 0.152: v36.58,14.63 39.17,17.22 39.62,17.22 43.13,20.73 v43.13,23.32
VDD_IO  (via drill 0.33)
  Top 0.152: SPI.2 11.43,12.04 10.21,10.82 10.21,8.84 8.99,7.62 JP2.2 | v27.89,20.88 27.89,20.57 28.65,20.57 U1.VDD_IO 28.65,20.42 28.65,19.05 v28.35,18.75
  Bottom 0.152: v27.89,20.88 28.19,20.57 33.83,20.57 36.88,17.53 39.47,17.53 41.91,19.96 POWER.4 | SPI.2 10.06,16.61 10.06,19.05 13.11,19.05 13.41,18.75 15.85,18.75 16,18.9 17.07,18.9 17.22,18.75 v28.35,18.75
VREG_ENA  (via drill 0.33)
  Top 0.152: POWER.3 44.5,24.08 44.5,20.57 44.65,20.42 U1.VREG_ENA 44.65,20.27 44.35,19.96 44.35,16.92 v35.81,8.38 | v18.75,4.57 18.14,3.96 v14.33,3.96 | v9.45,4.12 6.4,7.16 6.4,7.62 JP1.2
  Bottom 0.152: JP4.1 15.54,10.67 13.72,8.84 7.62,8.84 6.4,7.62 JP1.2 | v35.81,8.38 34.59,7.16 28.96,7.16 28.19,6.4 24.08,6.4 22.25,4.57 v18.75,4.57 | v14.33,3.96 14.17,4.12 v9.45,4.12

### Text on the board
bPlace: WT32 BB v1.0 | sectorfej.net
tDocu: P10 | P9 P8 P7 P6 P5 P4 P3 P2 P1 P0 A1 A0 IO | LED CHG BAT ENA RES | DGND | RTS RXD TXD GND VCC CTS | CSB | SCK | MISO | D- | D+ | GND | MOSI | VDD | VDD | Bluegiga / WT32-A | PWR | ENA BAT | IO | 3V3 TXD RTS CTS RXD SYN CLK OUT ORP ORN OLP OLN | 5V | IN | MBI | IRP | IRN | ILP | ILN | AGND
bDocu: PWR | CHG | PIO5